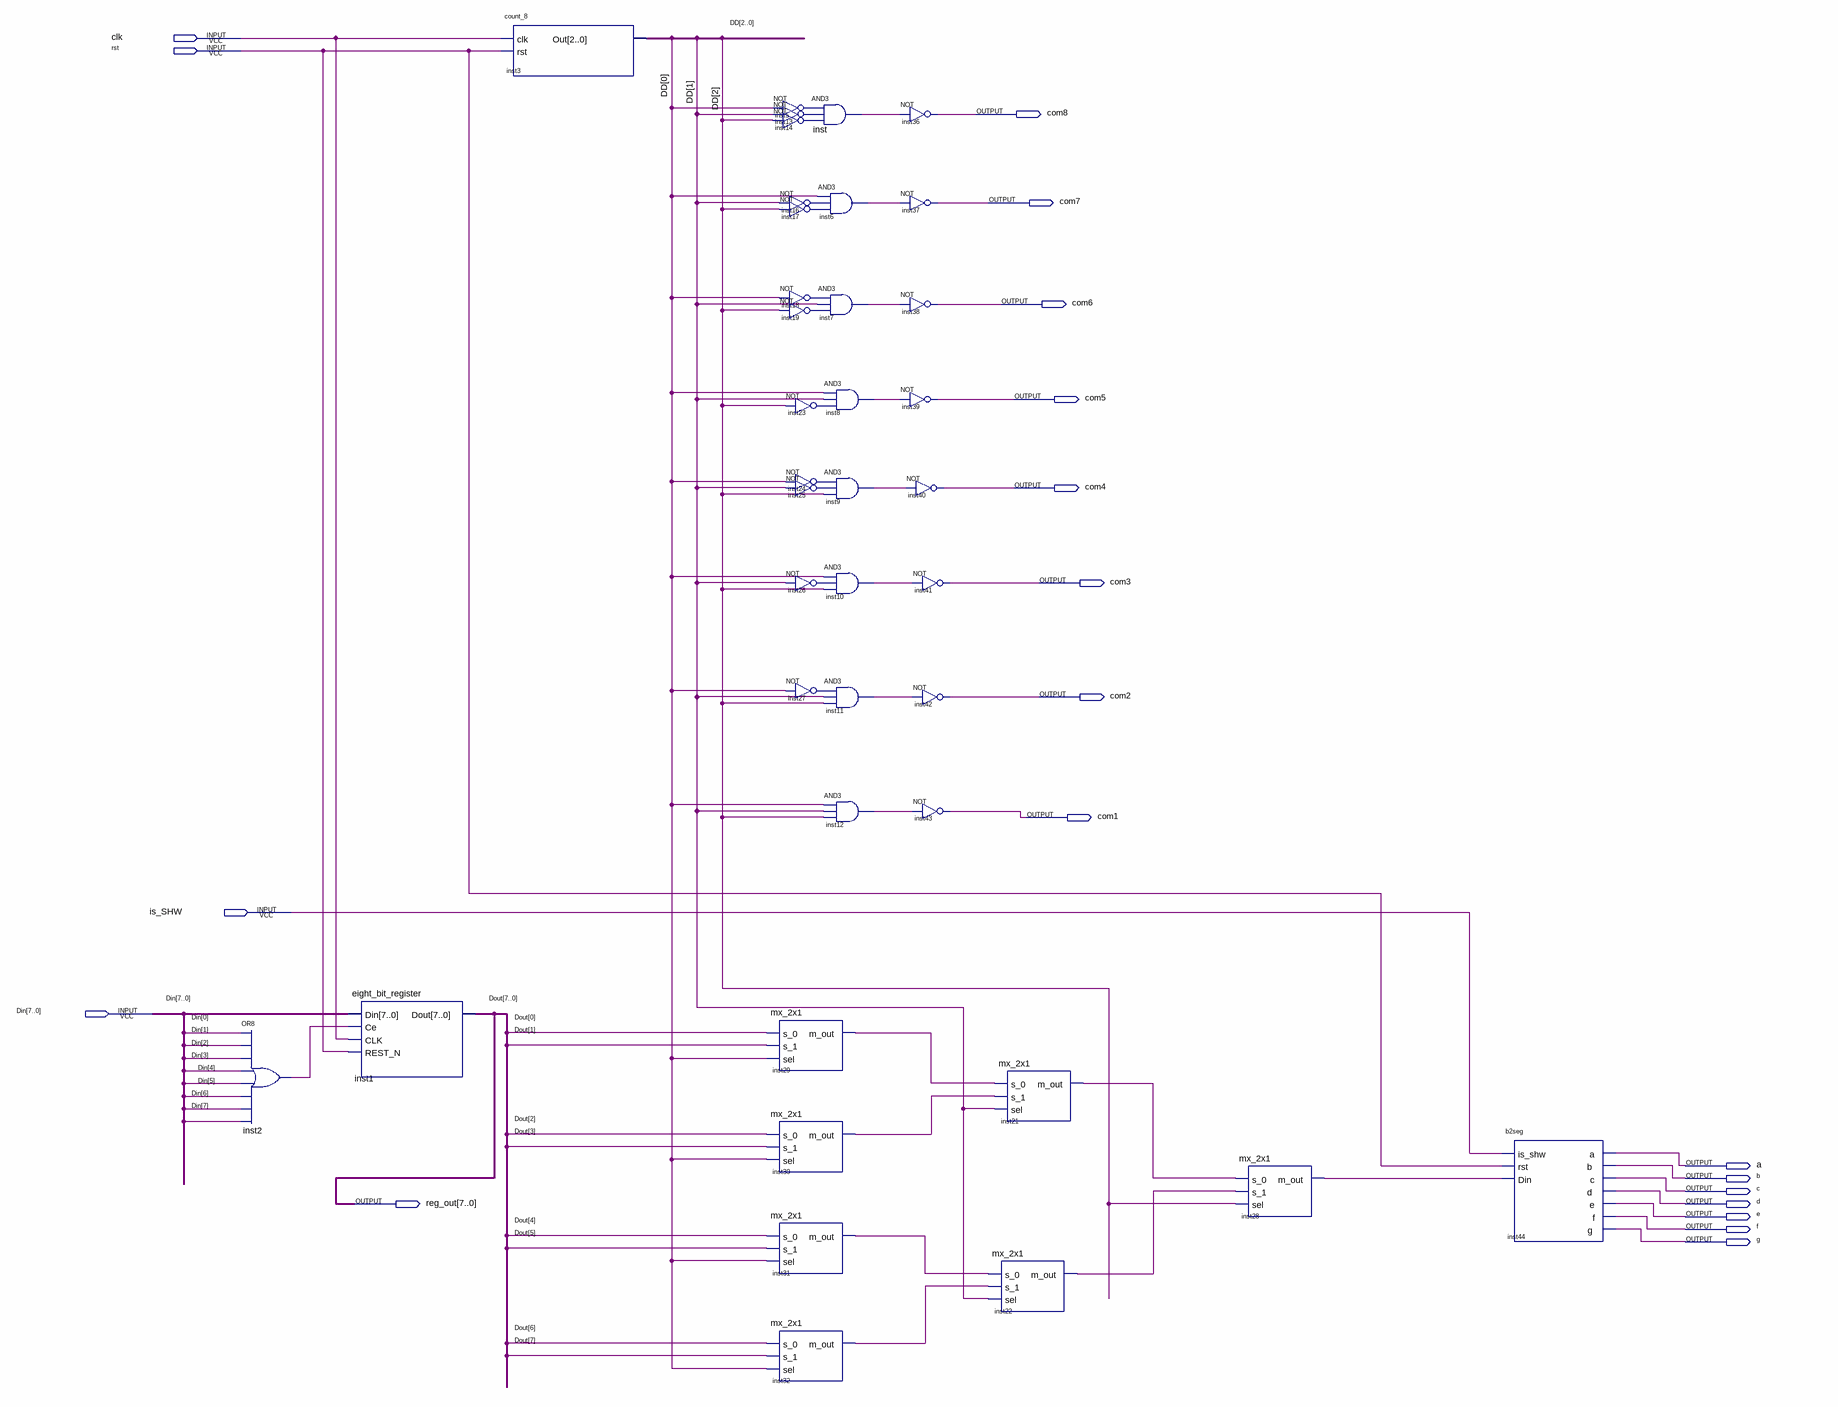
[diagram p0: schematic sheet]
// Quartus schematic shw_module.bdf as structural Verilog: 39 symbols, 20 pins
module shw_module (
  input  clk,
  input  rst,
  input  is_SHW,
  input  [7:0] Din,
  output com8,
  output com7,
  output com6,
  output com5,
  output com4,
  output com3,
  output com2,
  output com1,
  output a,
  output b,
  output c,
  output [7:0] reg_out,
  output d,
  output e,
  output f,
  output g
);

  wire inst2_out, inst5_out, inst6_out, inst7_out, inst8_out, inst9_out, inst10_out, inst11_out, inst12_out,
       inst13_out, inst14_out, inst16_out, inst17_out, inst18_out, inst19_out, inst21_m_out, inst22_m_out,
       inst23_out, inst24_out, inst25_out, inst26_out, inst27_out, inst28_m_out, inst29_m_out, inst30_m_out,
       inst31_m_out, inst32_m_out, inst_out;
  wire [2:0] DD;

  or inst2 (inst2_out, Din[0], Din[1], Din[2], Din[3], Din[4], Din[5], Din[6], Din[7]);
  eight_bit_register inst1 (.Din(Din), .Ce(inst2_out), .CLK(clk), .REST_N(rst), .Dout(reg_out));
  count_8 inst3 (.clk(clk), .rst(rst), .Out(DD));
  not inst5 (inst5_out, DD[0]);
  not inst13 (inst13_out, DD[1]);
  not inst14 (inst14_out, DD[2]);
  mx_2x1 inst29 (.s_0(reg_out[0]), .s_1(reg_out[1]), .sel(DD[0]), .m_out(inst29_m_out));
  mx_2x1 inst30 (.s_0(reg_out[2]), .s_1(reg_out[3]), .sel(DD[0]), .m_out(inst30_m_out));
  mx_2x1 inst31 (.s_0(reg_out[4]), .s_1(reg_out[5]), .sel(DD[0]), .m_out(inst31_m_out));
  mx_2x1 inst32 (.s_0(reg_out[6]), .s_1(reg_out[7]), .sel(DD[0]), .m_out(inst32_m_out));
  and inst (inst_out, inst5_out, inst13_out, inst14_out);
  and inst6 (inst6_out, DD[0], inst16_out, inst17_out);
  not inst16 (inst16_out, DD[1]);
  not inst17 (inst17_out, DD[2]);
  and inst7 (inst7_out, inst18_out, DD[1], inst19_out);
  not inst18 (inst18_out, DD[0]);
  not inst19 (inst19_out, DD[2]);
  and inst8 (inst8_out, DD[0], DD[1], inst23_out);
  not inst23 (inst23_out, DD[2]);
  and inst9 (inst9_out, inst24_out, inst25_out, DD[2]);
  not inst24 (inst24_out, DD[0]);
  not inst25 (inst25_out, DD[1]);
  and inst10 (inst10_out, DD[0], inst26_out, DD[2]);
  not inst26 (inst26_out, DD[1]);
  and inst11 (inst11_out, inst27_out, DD[1], DD[2]);
  not inst27 (inst27_out, DD[0]);
  and inst12 (inst12_out, DD[0], DD[1], DD[2]);
  not inst36 (com8, inst_out);
  not inst37 (com7, inst6_out);
  not inst38 (com6, inst7_out);
  not inst39 (com5, inst8_out);
  not inst40 (com4, inst9_out);
  not inst41 (com3, inst10_out);
  not inst42 (com2, inst11_out);
  not inst43 (com1, inst12_out);
  mx_2x1 inst21 (.s_0(inst29_m_out), .s_1(inst30_m_out), .sel(DD[1]), .m_out(inst21_m_out));
  mx_2x1 inst22 (.s_0(inst31_m_out), .s_1(inst32_m_out), .sel(DD[1]), .m_out(inst22_m_out));
  mx_2x1 inst28 (.s_0(inst21_m_out), .s_1(inst22_m_out), .sel(DD[2]), .m_out(inst28_m_out));
  b2seg inst44 (.is_shw(is_SHW), .rst(rst), .Din(inst28_m_out), .a(a), .b(b), .c(c), .d(d), .e(e), .f(f), .g(g));

  // Other names for the same wires on the sheet: Dout[7:0] = reg_out
endmodule
